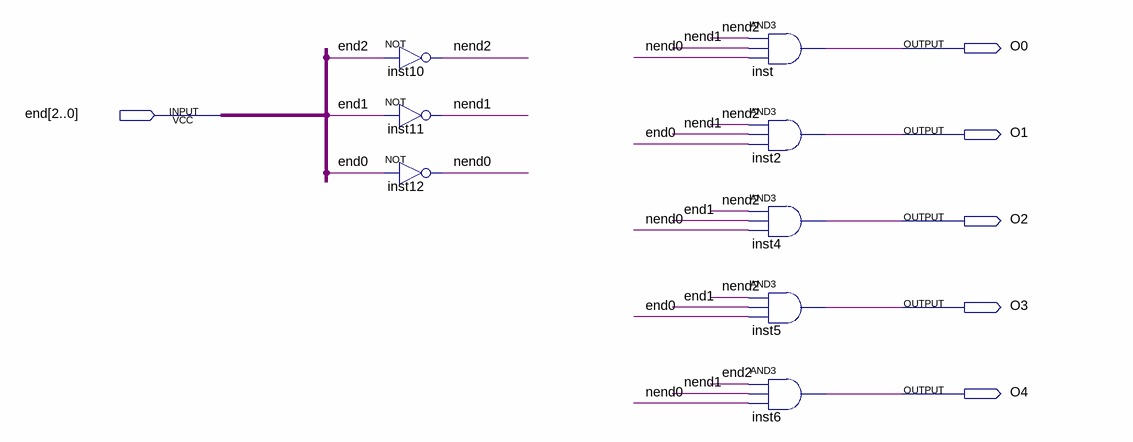
[diagram p0: schematic sheet]
// Quartus schematic decodificador2.bdf as structural Verilog: 8 symbols, 6 pins
module decodificador2 (
  input  [2:0] \end ,
  output O0,
  output O1,
  output O2,
  output O3,
  output O4
);

  wire nend0, nend1, nend2;

  not inst10 (nend2, \end [2]);
  not inst11 (nend1, \end [1]);
  not inst12 (nend0, \end [0]);
  and inst (O0, nend2, nend1, nend0);
  and inst2 (O1, nend2, nend1, \end [0]);
  and inst4 (O2, nend2, \end [1], nend0);
  and inst5 (O3, nend2, \end [1], \end [0]);
  and inst6 (O4, \end [2], nend1, nend0);
endmodule
